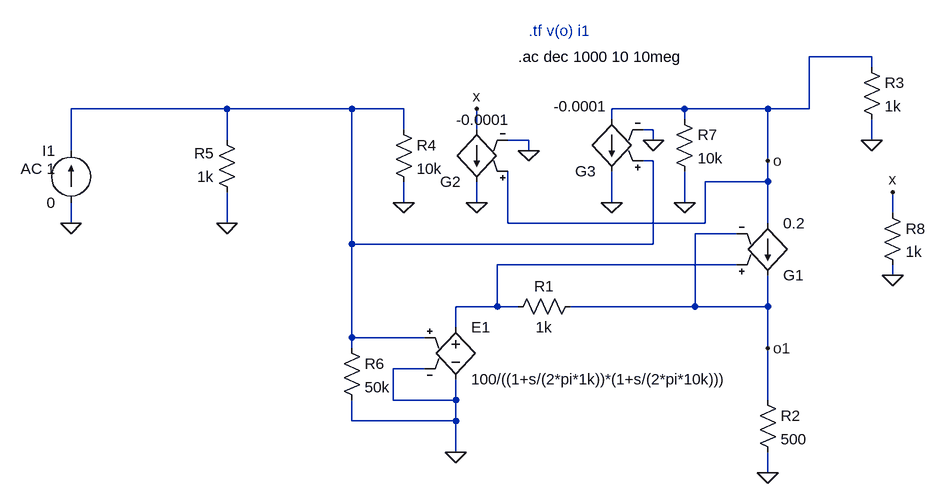
[diagram p0: schematic pruebametodo2_1.asc]
pruebametodo2_1.asc, the LTspice schematic file:
Version 4
SHEET 1 1112 1092
WIRE 880 -288 784 -288
WIRE 880 -272 880 -288
WIRE -112 -208 -352 -208
WIRE 80 -208 -112 -208
WIRE 160 -208 80 -208
WIRE 592 -208 480 -208
WIRE 720 -208 592 -208
WIRE 784 -208 784 -288
WIRE 784 -208 720 -208
WIRE 480 -192 480 -208
WIRE 592 -192 592 -208
WIRE 160 -176 160 -208
WIRE 272 -176 272 -208
WIRE 544 -176 528 -176
WIRE -112 -160 -112 -208
WIRE 352 -160 320 -160
WIRE 544 -160 544 -176
WIRE 880 -160 880 -192
WIRE -352 -144 -352 -208
WIRE 352 -144 352 -160
WIRE 544 -128 528 -128
WIRE 720 -128 720 -208
WIRE 720 -96 720 -128
WIRE 720 -96 624 -96
WIRE 160 -64 160 -96
WIRE 272 -64 272 -96
WIRE 480 -64 480 -112
WIRE 592 -64 592 -112
WIRE 912 -48 912 -80
WIRE -352 -32 -352 -64
WIRE -112 -32 -112 -80
WIRE 320 -32 320 -112
WIRE 624 -32 624 -96
WIRE 624 -32 320 -32
WIRE 720 -32 720 -96
WIRE 672 -16 608 -16
WIRE 80 0 80 -208
WIRE 544 0 544 -128
WIRE 544 0 80 0
WIRE 672 32 304 32
WIRE 912 48 912 32
WIRE 304 96 304 32
WIRE 304 96 240 96
WIRE 336 96 304 96
WIRE 608 96 608 -16
WIRE 608 96 416 96
WIRE 720 96 720 48
WIRE 720 96 608 96
WIRE 240 128 240 96
WIRE 80 144 80 0
WIRE 192 144 80 144
WIRE 80 160 80 144
WIRE 720 160 720 96
WIRE 192 192 144 192
WIRE 144 240 144 192
WIRE 240 240 240 208
WIRE 240 240 144 240
WIRE 720 240 720 160
WIRE 80 272 80 240
WIRE 240 272 240 240
WIRE 240 272 80 272
WIRE 240 320 240 272
WIRE 720 352 720 320
FLAG 240 320 0
FLAG 720 352 0
FLAG 880 -160 0
FLAG -352 -32 0
FLAG 720 -128 o
FLAG 720 160 o1
FLAG 160 -64 0
FLAG 272 -64 0
FLAG 480 -64 0
FLAG 592 -64 0
FLAG 352 -144 0
FLAG 544 -160 0
FLAG -112 -32 0
FLAG 272 -208 x
FLAG 912 48 0
FLAG 912 -80 x
SYMBOL e 240 112 R0
SYMATTR InstName E1
SYMATTR Value 100/((1+s/(2*pi*1k))*(1+s/(2*pi*10k)))
SYMATTR SpiceModel laplace
SYMBOL res 320 112 R270
WINDOW 0 32 56 VTop 2
WINDOW 3 0 56 VBottom 2
SYMATTR InstName R1
SYMATTR Value 1k
SYMBOL g 720 64 M180
SYMATTR InstName G1
SYMATTR Value 0.2
SYMBOL res 704 224 R0
SYMATTR InstName R2
SYMATTR Value 500
SYMBOL res 864 -288 R0
SYMATTR InstName R3
SYMATTR Value 1k
SYMBOL res -96 -64 R180
WINDOW 0 36 76 Left 2
WINDOW 3 36 40 Left 2
SYMATTR InstName R5
SYMATTR Value 1k
SYMBOL res 64 144 R0
SYMATTR InstName R6
SYMATTR Value 50k
SYMBOL res 144 -192 R0
SYMATTR InstName R4
SYMATTR Value 10k
SYMBOL res 576 -208 R0
SYMATTR InstName R7
SYMATTR Value 10k
SYMBOL g 272 -80 R180
WINDOW 3 -51 111 Left 2
SYMATTR Value -0.0001
SYMATTR InstName G2
SYMBOL g 480 -96 R180
WINDOW 3 7 116 Left 2
SYMATTR Value -0.0001
SYMATTR InstName G3
SYMBOL current -352 -64 R180
WINDOW 0 24 80 Left 2
WINDOW 3 24 0 Left 2
WINDOW 123 24 52 Left 2
WINDOW 39 0 0 Left 0
SYMATTR InstName I1
SYMATTR Value 0
SYMATTR Value2 AC 1
SYMBOL res 896 -64 R0
SYMATTR InstName R8
SYMATTR Value 1k
TEXT 352 -328 Left 2 ;.tf v(o) i1
TEXT 336 -288 Left 2 !.ac dec 1000 10 10meg

The netlist it stands for:
* pruebametodo2_1.asc
E1 N002 0 N001 0 laplace 100/((1+s/(2*pi*1k))*(1+s/(2*pi*10k)))
R1 N002 o1 1k
G1 o o1 N002 o1 0.2
R2 o1 0 500
R3 o 0 1k
R5 0 N001 1k
R6 N001 0 50k
R4 N001 0 10k
R7 o 0 10k
G2 x 0 o 0 -0.0001
G3 o 0 N001 0 -0.0001
I1 0 N001 0 AC 1
R8 x 0 1k
* .tf v(o) i1
.ac dec 1000 10 10meg
.backanno
.end